# EAGLE board mg5001dev-1.0p10 (EAGLE 4.11), part 1 of 2
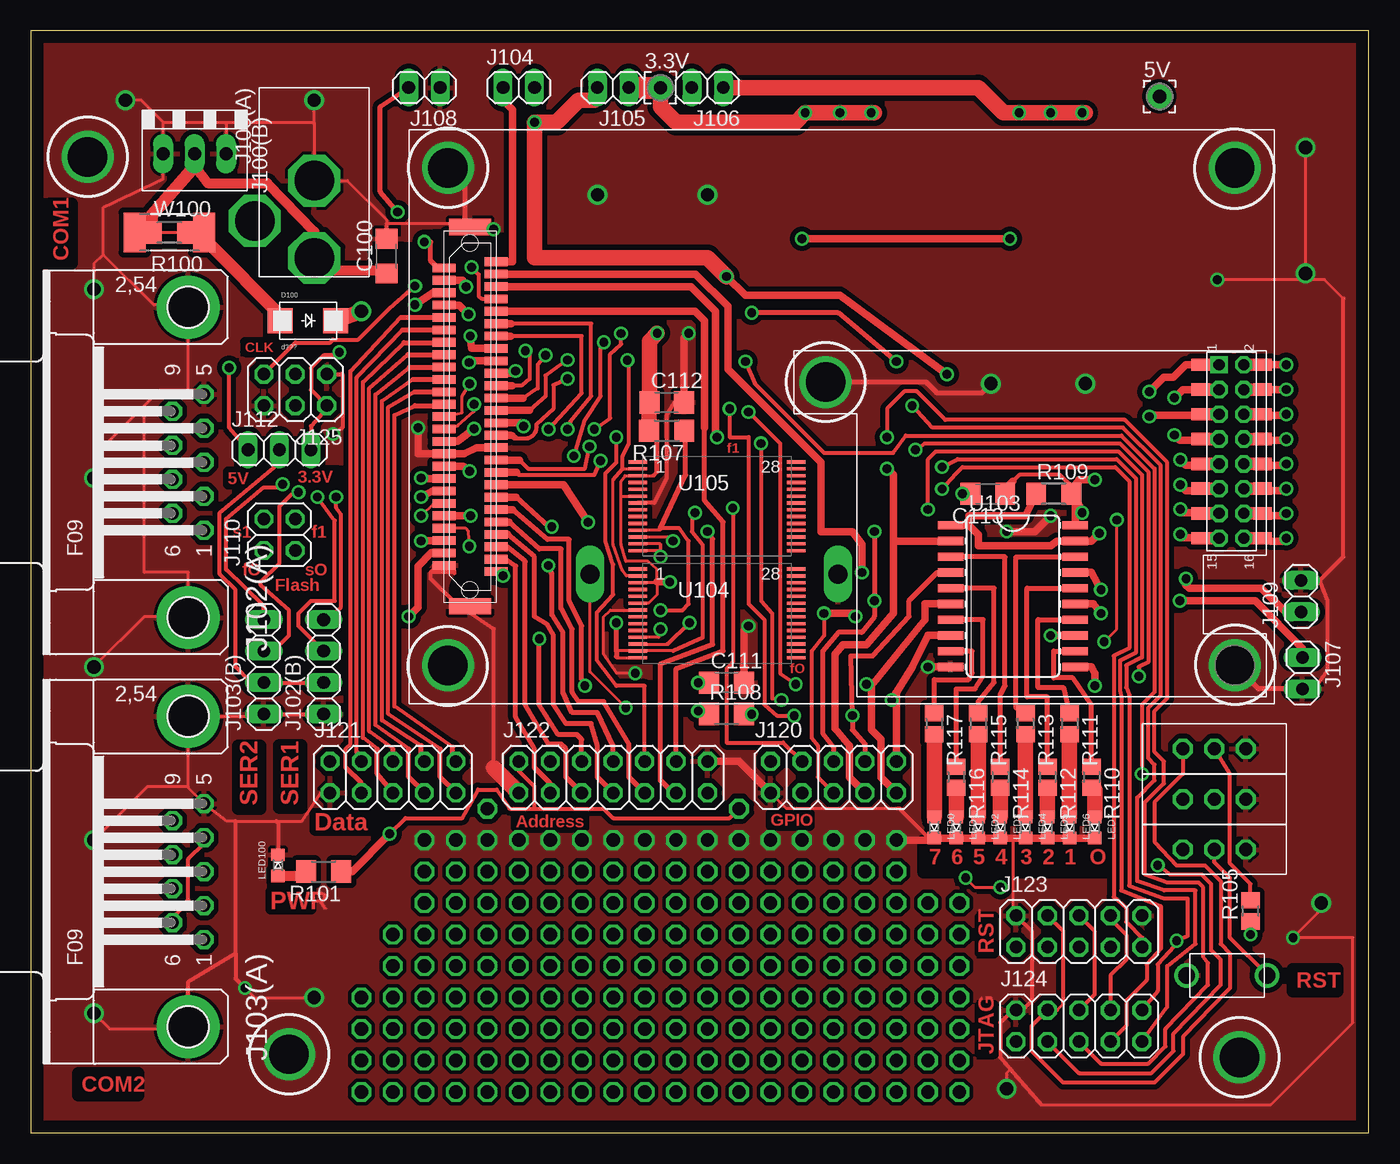
[diagram p1: board, top side]
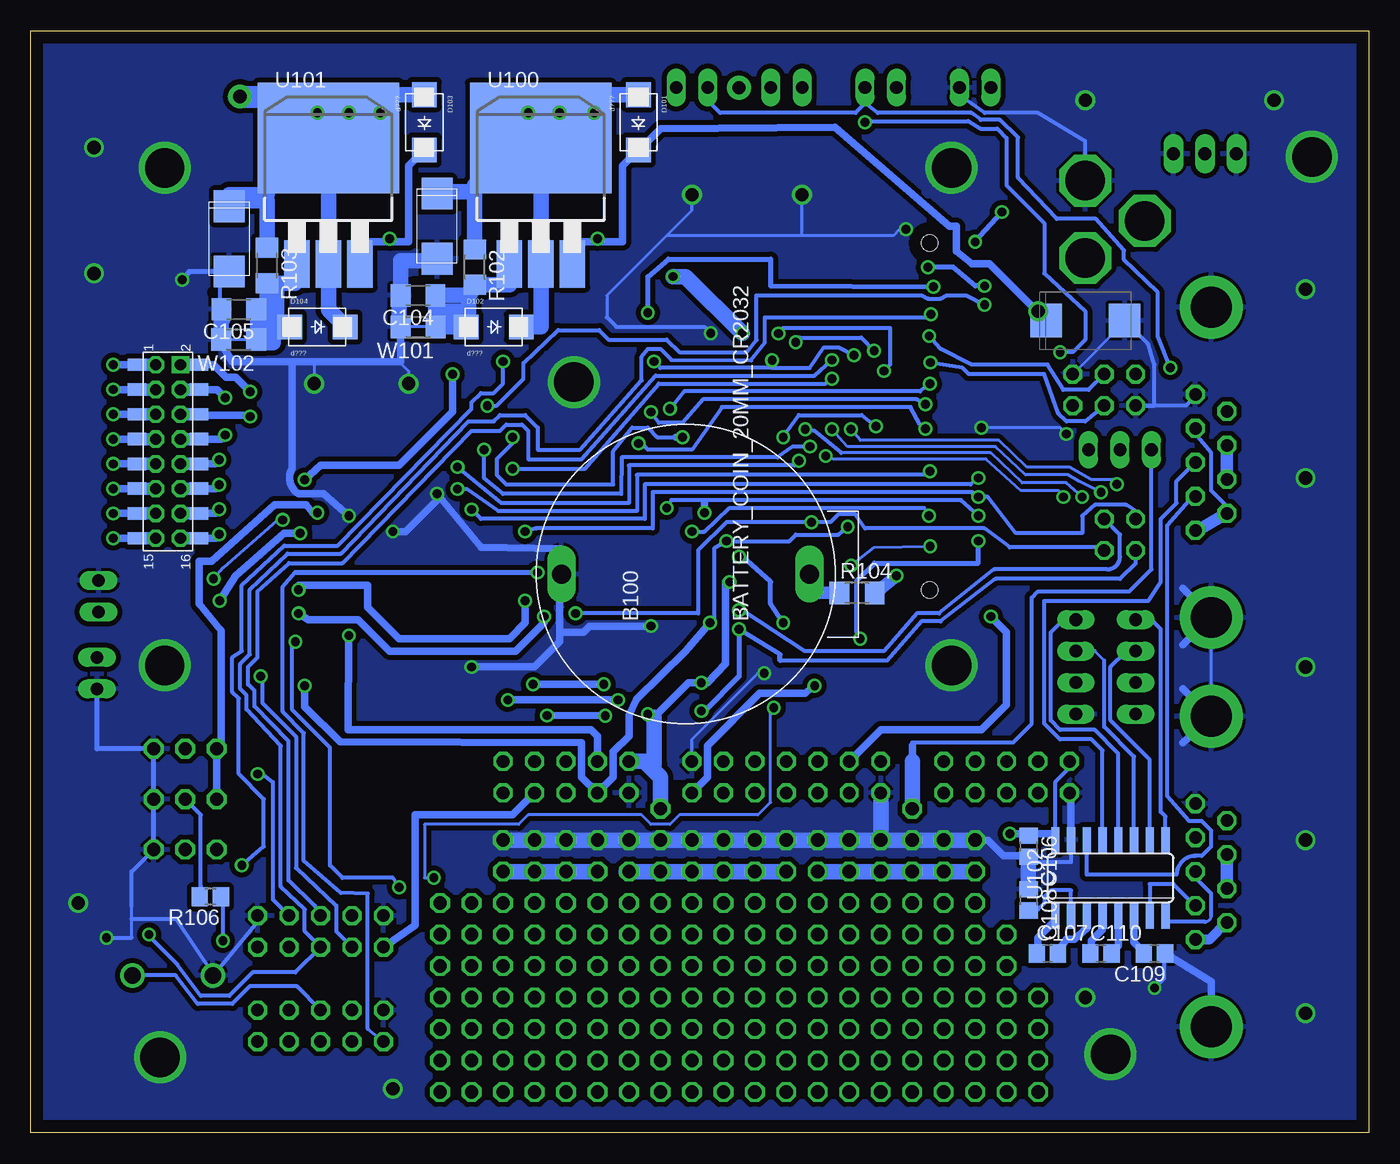
[diagram p2: board, bottom side, seen from below]

Size 107.95 x 88.9 mm. Coordinates in mm from the lower left corner, seen from the top.
Outline: 0,0 107.95,0 107.95,88.9 0,88.9 0,0
Copper layers (1*16): Top 0.035mm / dielectric 1.5mm / Bottom 0.035mm
Design rules "default": minimum track width 8mil, minimum drill 24mil, track to track 8mil, track to pad 8mil, pad to pad 8mil, via to via 8mil, smd to smd 8mil, copper to edge 40mil, drill to drill 8mil, minimum pad ring 10mil, minimum via ring 8mil, stop-mask expansion 4mil, vias tented up to drill 0mil, thermal gap 10mil
tRestrict: area 101.9,11.4 to 105.4,13.2; area 72,21 to 86.9,23.6; area 3.8,3 to 8.6,4.8; area 1.5,70.2 to 3.3,75; area 16.7,26.2 to 18.5,31.2; area 20,26.2 to 21.8,31.3; 20 lines
bRestrict: 15 lines

## Footprints (pad centres in the part's own frame; a part is rotated, then mirrored left to right if it is on the bottom)
PAD_ROUND_APC-FREE_0.1/042 = drill 1.067 pad 1.93 round: PAD 0,0
MEMORY_PROTECTION_DEVICES_BH32T_20MM_COIN_CELL_HOLDER = drill 1.524 long: + 0,-9.982; - 0,10.008
C1206 = smd 1.6 x 1.8: 1 -1.4,0; 2 1.4,0
EIA-7343-31 = smd 2.55 x 2.7: + 3.175,0; - -3.175,0
EIA-6032-28 = smd 2.55 x 2.5: + 2.625,0; - -2.625,0
C0805 = smd 1.3 x 1.5: 1 -0.85,0; 2 0.85,0
SMA-DIODE = smd 2 x 2: 1(ANODE) -2.232,0; 2(CATHODE) 2.24,0
SWITCHCRAFT-2.1MM-COAXIAL-POWER = drill 3.175 octagon: BBM 10.744,-4.801; RING 7.493,0; TIP 13.741,0
EUROBLOCK-2.54-X3 = drill 1.067 long: 1 0,2.54; 2 0,0; 3 0,-2.54
MG5001-FOOTPRINT = smd 1.85 x 0.7: 1 2.1,12.5; 2 -2.1,12; 3 2.1,11.5; 4 -2.1,11; 5 2.1,10.5; 6 -2.1,10; 7 2.1,9.5; 8 -2.1,9; 9 2.1,8.5; 10 -2.1,8; 11 2.1,7.5; 12 -2.1,7; 13 2.1,6.5; 14 -2.1,6; 15 2.1,5.5; 16 -2.1,5; 17 2.1,4.5; 18 -2.1,4; 19 2.1,3.5; 20 -2.1,3; 21 2.1,2.5; 22 -2.1,2; 23 2.1,1.5; 24 -2.1,1; 25 2.1,0.5; 26 -2.1,0; 27 2.1,-0.5; 28 -2.1,-1; 29 2.1,-1.5; 30 -2.1,-2; 31 2.1,-2.5; 32 -2.1,-3; 33 2.1,-3.5; 34 -2.1,-4; 35 2.1,-4.5; 36 -2.1,-5; 37 2.1,-5.5; 38 -2.1,-6; 39 2.1,-6.5; 40 -2.1,-7; 41 2.1,-7.5; 42 -2.1,-8; 43 2.1,-8.5; 44 -2.1,-9; 45 2.1,-9.5; 46 -2.1,-10; 47 2.1,-10.5; 48 -2.1,-11; 49 2.1,-11.5; 50 -2.1,-12; 51 2.1,-12.5 | smd 3.4 x 1.3: A 0,15.3; B 0,-15.3 | drill 3.175 round: G1 -1.778,-20.066; G2 61.722,-20.066; G3 61.722,20.066; G4 -1.778,20.066 | hole 1.321: 0,14; 0,-14
F09HP = drill 1.016 octagon: 1 -5.486,-1.27; 2 -2.743,-1.27; 3 0,-1.27; 4 2.743,-1.27; 5 5.486,-1.27; 6 -4.115,1.27; 7 -1.372,1.27; 8 1.372,1.27; 9 4.115,1.27 | drill 3.302 pad 5.08 round: G1 -12.522,0; G2 12.522,0
1X04 = drill 1.016 long: 1 -3.81,0; 2 -1.27,0; 3 1.27,0; 4 3.81,0
1X02 = drill 1.016 long: 1 -1.27,0; 2 1.27,0
2X02 = drill 1.016 octagon: 1 -1.27,-1.27; 2 -1.27,1.27; 3 1.27,-1.27; 4 1.27,1.27
1X03 = drill 1.016 long: 1 -2.54,0; 2 0,0; 3 2.54,0
2X05 = drill 1.016 octagon: 1 -5.08,-1.27; 2 -5.08,1.27; 3 -2.54,-1.27; 4 -2.54,1.27; 5 0,-1.27; 6 0,1.27; 7 2.54,-1.27; 8 2.54,1.27; 9 5.08,-1.27; 10 5.08,1.27
2X07 = drill 1.016 octagon: 1 -7.62,-1.27; 2 -7.62,1.27; 3 -5.08,-1.27; 4 -5.08,1.27; 5 -2.54,-1.27; 6 -2.54,1.27; 7 0,-1.27; 8 0,1.27; 9 2.54,-1.27; 10 2.54,1.27; 11 5.08,-1.27; 12 5.08,1.27; 13 7.62,-1.27; 14 7.62,1.27
2X03 = drill 1.016 octagon: 1 -2.54,-1.27; 2 -2.54,1.27; 3 0,-1.27; 4 0,1.27; 5 2.54,-1.27; 6 2.54,1.27
MG5003-FOOTPRINT-ONE_HOLE = drill 0.889 pad 1.372 square: 1 1,-7 | drill 0.889 pad 1.372 octagon: 2 -1,-7; 3 1,-5; 4 -1,-5; 5 1,-3; 6 -1,-3; 7 1,-1; 8 -1,-1; 9 1,1; 10 -1,1; 11 1,3; 12 -1,3; 13 1,5; 14 -1,5; 15 1,7; 16 -1,7 | drill 3.175 round: G2 32.75,-5.603
2MM-2X8-SMT = smd 1 x 1.5: 1 -7,-2.5; 2 -7,2.5; 3 -5,-2.5; 4 -5,2.5; 5 -3,-2.5; 6 -3,2.5; 7 -1,-2.5; 8 -1,2.5; 9 1,-2.5; 10 1,2.5; 11 3,-2.5; 12 3,2.5; 13 5,-2.5; 14 5,2.5; 15 7,-2.5; 16 7,2.5
0603-DIODE = smd 1 x 1.1: A -0.85,0; K 0.85,0
R2512 = smd 1.8 x 3.2: 1 -2.8,0; 2 2.8,0
R1206 = smd 1.6 x 1.803: 1 -1.422,0; 2 1.422,0
R0805 = smd 1.3 x 1.5: 1 -0.85,0; 2 0.85,0
SW_6X3.5MM = drill 1.321 round: 1 -3.25,0; 2 3.25,0
0.1_IN_HEADER_FOR_SWITCH = drill 1.067 octagon: CENTER 0,0; LEFT -2.54,0; RIGHT 2.54,0
TO263/D2PAK-3 = smd 2.083 x 3.81: 1 -2.54,0; 2 0,0; 3 2.54,0 | smd 11.43 x 8.89: TAB 0,10.16
SO16 = smd 0.66 x 2.032: 1 -4.445,-3.073; 2 -3.175,-3.073; 3 -1.905,-3.073; 4 -0.635,-3.073; 5 0.635,-3.073; 6 1.905,-3.073; 7 3.175,-3.073; 8 4.445,-3.073; 9 4.445,3.073; 10 3.175,3.073; 11 1.905,3.073; 12 0.635,3.073; 13 -0.635,3.073; 14 -1.905,3.073; 15 -3.175,3.073; 16 -4.445,3.073
SO20W = smd 0.66 x 2.032: 1 -5.715,-5.029; 2 -4.445,-5.029; 3 -3.175,-5.029; 4 -1.905,-5.029; 5 -0.635,-5.029; 6 0.635,-5.029; 7 1.905,-5.029; 8 3.175,-5.029; 9 4.445,-5.029; 10 5.715,-5.029; 11 5.715,5.029; 12 4.445,5.029; 13 3.175,5.029; 14 1.905,5.029; 15 0.635,5.029; 16 -0.635,5.029; 17 -1.905,5.029; 18 -3.175,5.029; 19 -4.445,5.029; 20 -5.715,5.029
TSOP-28-8X13.4 = smd 0.26 x 1.5: 1 -3.575,-6.4; 2 -3.025,-6.4; 3 -2.475,-6.4; 4 -1.925,-6.4; 5 -1.375,-6.4; 6 -0.825,-6.4; 7 -0.275,-6.4; 8 0.275,-6.4; 9 0.825,-6.4; 10 1.375,-6.4; 11 1.925,-6.4; 12 2.475,-6.4; 13 3.025,-6.4; 14 3.575,-6.4; 15 3.575,6.4; 16 3.025,6.4; 17 2.475,6.4; 18 1.925,6.4; 19 1.375,6.4; 20 0.825,6.4; 21 0.275,6.4; 22 -0.275,6.4; 23 -0.825,6.4; 24 -1.375,6.4; 25 -1.925,6.4; 26 -2.475,6.4; 27 -3.025,6.4; 28 -3.575,6.4
ZJ-1206 = smd 1.6 x 1.803: 1 -1.422,0; 2 1.422,0

## Placement (x,y rotation side)
3.3V  [PAD_ROUND_APC-FREE_0.1/042]  50.8,84.33 0 top
5V  [PAD_ROUND_APC-FREE_0.1/042]  91.08,83.62 0 top
B100  BATTERY_COIN_20MM_CR2032  [MEMORY_PROTECTION_DEVICES_BH32T_20MM_COIN_CELL_HOLDER]  55.12,45.09 90 bottom
C100  .1  [C1206]  28.7,70.74 90 top
C101  10  [EIA-7343-31]  22.86,65.53 180 bottom
C102  22  [EIA-6032-28]  75.18,73.15 90 bottom
C103  22  [EIA-6032-28]  91.95,72.14 90 bottom
C104  [C1206]  76.71,67.56 180 bottom
C105  [C1206]  91.19,66.45 180 bottom
C106  .1  [C0805]  27.43,23.11 270 bottom
C107  .1  [C0805]  25.91,14.48 0 bottom
C108  .1  [C0805]  27.43,18.8 270 bottom
C109  .1  [C0805]  17.27,14.48 180 bottom
C110  .1  [C0805]  21.59,14.48 0 bottom
C111  [C1206]  56.13,36.32 0 top
C112  [C1206]  51.31,58.93 0 top
C113  [C1206]  77.22,51.56 180 top
D100  d???  [SMA-DIODE]  22.35,65.53 0 top
D101  d???  [SMA-DIODE]  58.93,81.53 270 bottom
D102  d???  [SMA-DIODE]  70.61,65.02 0 bottom
D103  d???  [SMA-DIODE]  76.2,81.53 270 bottom
D104  d???  [SMA-DIODE]  84.84,65.02 0 bottom
J100(A)  PWR  [SWITCHCRAFT-2.1MM-COAXIAL-POWER]  22.86,84.33 270 top
J100(B)  PWR_BLK  [EUROBLOCK-2.54-X3]  13.21,78.99 270 top
J101  DF9-51S-1V  [MG5001-FOOTPRINT]  35.43,57.78 0 top
J102(A)  Serial1  [F09HP]  12.7,54.1 90 top
J102(B)  COM1  [1X04]  23.62,37.59 90 top
J103(A)  Serial2  [F09HP]  12.7,21.08 90 top
J103(B)  COM2  [1X04]  18.8,37.59 90 top
J104  Vin  [1X02]  39.37,84.33 0 top
J105  [1X02]  46.99,84.33 180 top
J106  [1X02]  54.61,84.33 180 top
J107  LED  [1X02]  102.62,37.08 270 top
J108  VAnt  [1X02]  31.75,84.33 180 top
J109  ExtBat  [1X02]  102.49,43.31 90 top
J110  SPICTL  [2X02]  20.07,48.26 90 top
J112  SER_PWR  [1X03]  20.07,55.12 0 top
J120  GPIO  [2X05]  64.77,28.7 0 top
J121  Data  [2X05]  29.21,28.7 0 top
J122  Address/Select  [2X07]  46.99,28.7 0 top
J123  Reset  [2X05]  84.58,16.26 0 top
J124  JTAG  [2X05]  84.58,8.64 0 top
J125  CLKOUT/INT\  [2X03]  21.34,59.94 180 top
J200  MG5003 footprint  [MG5003-FOOTPRINT-ONE_HOLE]  96.89,54.97 180 top
J200A  MG5003-SMT top  [2MM-2X8-SMT]  96.89,54.97 270 top
J200B  MG5003-SMT bot  [2MM-2X8-SMT]  96.89,54.97 270 bottom
LED0  LED-RED-0603  [0603-DIODE]  72.9,24.64 270 top
LED1  LED-RED-0603  [0603-DIODE]  74.68,24.64 270 top
LED2  LED-RED-0603  [0603-DIODE]  76.45,24.64 270 top
LED3  LED-RED-0603  [0603-DIODE]  78.23,24.64 270 top
LED4  LED-RED-0603  [0603-DIODE]  80.26,24.64 270 top
LED5  LED-RED-0603  [0603-DIODE]  82.04,24.64 270 top
LED6  LED-RED-0603  [0603-DIODE]  83.82,24.64 270 top
LED7  LED-RED-0603  [0603-DIODE]  85.85,24.64 270 top
LED100  LED-GRN-  [0603-DIODE]  19.94,21.59 90 top
R100  1/1W  [R2512]  11.18,72.64 180 top
R101  1  [R1206]  23.62,21.08 180 top
R102  [R1206]  72.14,69.85 270 bottom
R103  [R1206]  88.9,69.98 270 bottom
R104  [R1206]  41.28,43.56 0 bottom
R105  10k  [R0805]  98.42,17.91 90 top
R106  10k  [R0805]  93.47,19.05 180 bottom
R107  [R1206]  51.31,56.64 180 top
R108  [R1206]  56.13,33.78 0 top
R109  [R1206]  82.55,51.56 0 top
R110  [R0805]  85.6,28.7 270 top
R111  [R0805]  83.82,33.02 270 top
R112  [R0805]  82.04,28.7 270 top
R113  [R0805]  80.26,33.02 270 top
R114  [R0805]  78.23,28.7 270 top
R115  [R0805]  76.45,33.02 270 top
R116  [R0805]  74.68,28.7 270 top
R117  [R0805]  72.9,33.02 270 top
S100(A)  Reset  [SW_6X3.5MM]  96.52,12.7 180 top
S100(B)  [0.1_IN_HEADER_FOR_SWITCH]  95.5,22.86 0 top
S101  [0.1_IN_HEADER_FOR_SWITCH]  95.5,30.99 0 top
S102  [0.1_IN_HEADER_FOR_SWITCH]  95.5,26.92 0 top
U100  Reg  [TO263/D2PAK-3]  66.8,70.1 0 bottom
U101  Reg  [TO263/D2PAK-3]  83.95,70.1 0 bottom
U102  MAX3232D  [SO16]  20.83,20.57 0 bottom
U103  74LS244DW  [SO20W]  79.25,43.31 270 top
U104  Serial Data Flash 0  [TSOP-28-8X13.4]  55.37,41.91 270 top
U105  Serial Data Flash 1  [TSOP-28-8X13.4]  55.37,50.55 270 top
W100  R9  [ZJ-1206]  11.18,72.64 0 top
W101  R9  [ZJ-1206]  76.71,65.02 180 bottom
W102  R9  [ZJ-1206]  91.19,64.01 180 bottom